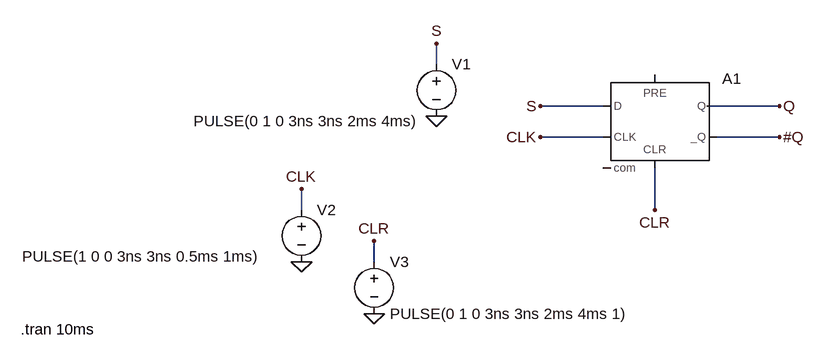
[diagram p0: schematic FlipFlop.asc]
FlipFlop.asc, the LTspice schematic file:
Version 4
SHEET 1 880 680
WIRE -80 64 -80 32
WIRE 176 128 80 128
WIRE 448 128 336 128
WIRE 176 176 80 176
WIRE 448 176 352 176
WIRE -288 288 -288 256
WIRE 256 288 256 224
WIRE -176 368 -176 336
FLAG 80 128 S
FLAG 80 176 CLK
FLAG 448 128 Q
FLAG 448 176 #Q
FLAG 256 288 CLR
FLAG -80 144 0
FLAG -288 368 0
FLAG -176 448 0
FLAG -80 32 S
FLAG -288 256 CLK
FLAG -176 336 CLR
SYMBOL Digital\\dflop 256 80 R0
SYMATTR InstName A1
SYMBOL voltage -80 48 R0
WINDOW 3 -374 103 Left 2
WINDOW 123 0 0 Left 0
WINDOW 39 0 0 Left 0
SYMATTR InstName V1
SYMATTR Value PULSE(0 1 0 3ns 3ns 2ms 4ms)
SYMBOL voltage -288 272 R0
WINDOW 3 -430 88 Left 2
WINDOW 123 0 0 Left 0
WINDOW 39 0 0 Left 0
SYMATTR InstName V2
SYMATTR Value PULSE(1 0 0 3ns 3ns 0.5ms 1ms)
SYMBOL voltage -176 352 R0
WINDOW 123 0 0 Left 0
WINDOW 39 0 0 Left 0
SYMATTR InstName V3
SYMATTR Value PULSE(0 1 0 3ns 3ns 2ms 4ms 1)
TEXT -720 472 Left 2 !.tran 10ms

The netlist it stands for:
* FlipFlop.asc
A1 S 0 CLK 0 CLR #Q Q 0 DFLOP
V1 S 0 PULSE(0 1 0 3ns 3ns 2ms 4ms)
V2 CLK 0 PULSE(1 0 0 3ns 3ns 0.5ms 1ms)
V3 CLR 0 PULSE(0 1 0 3ns 3ns 2ms 4ms 1)
.tran 10ms
.backanno
.end